# Altium schematic sheet p.SchDoc
size A1
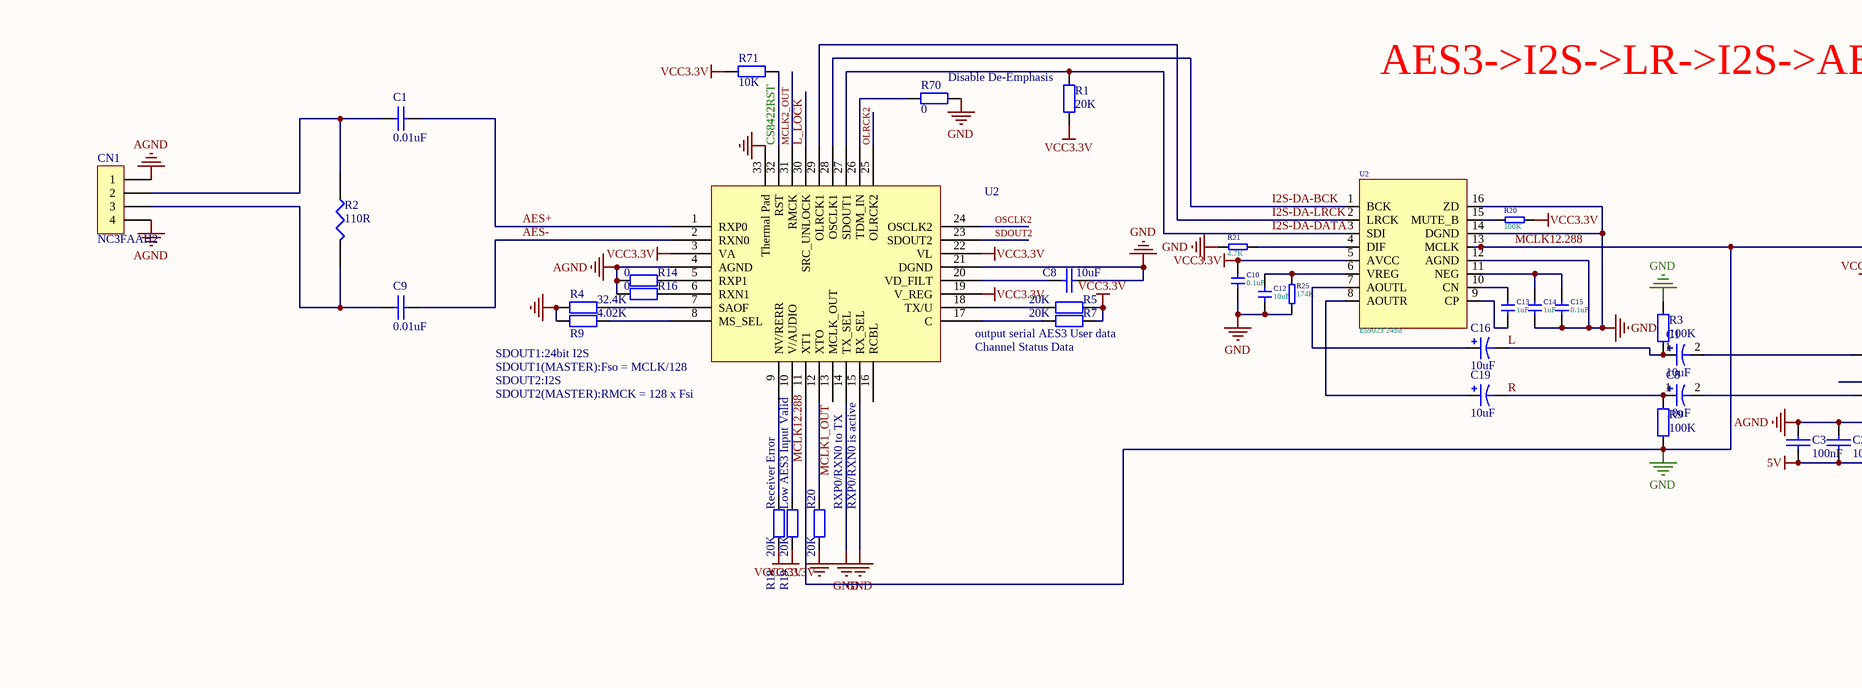
[diagram p0: p.SchDoc, top left]
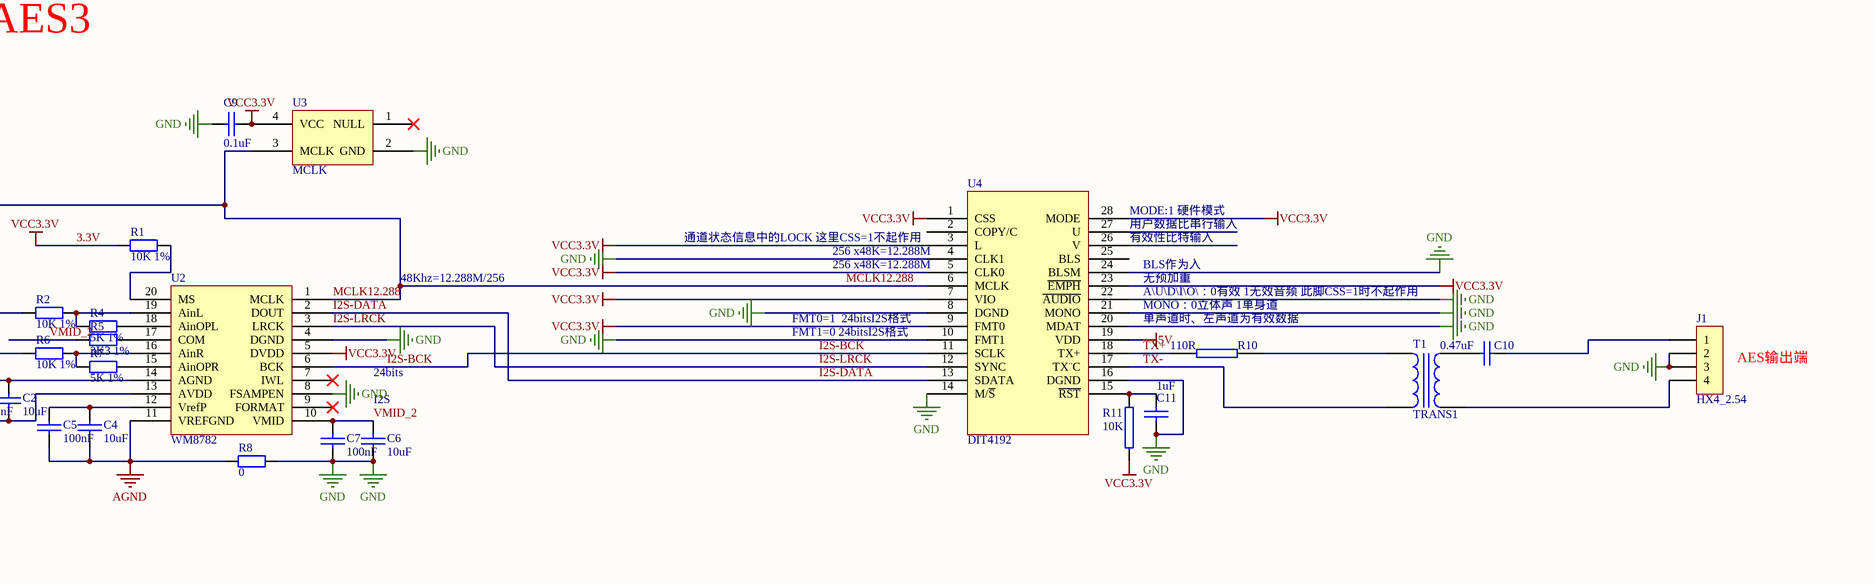
[diagram p1: p.SchDoc, top right]
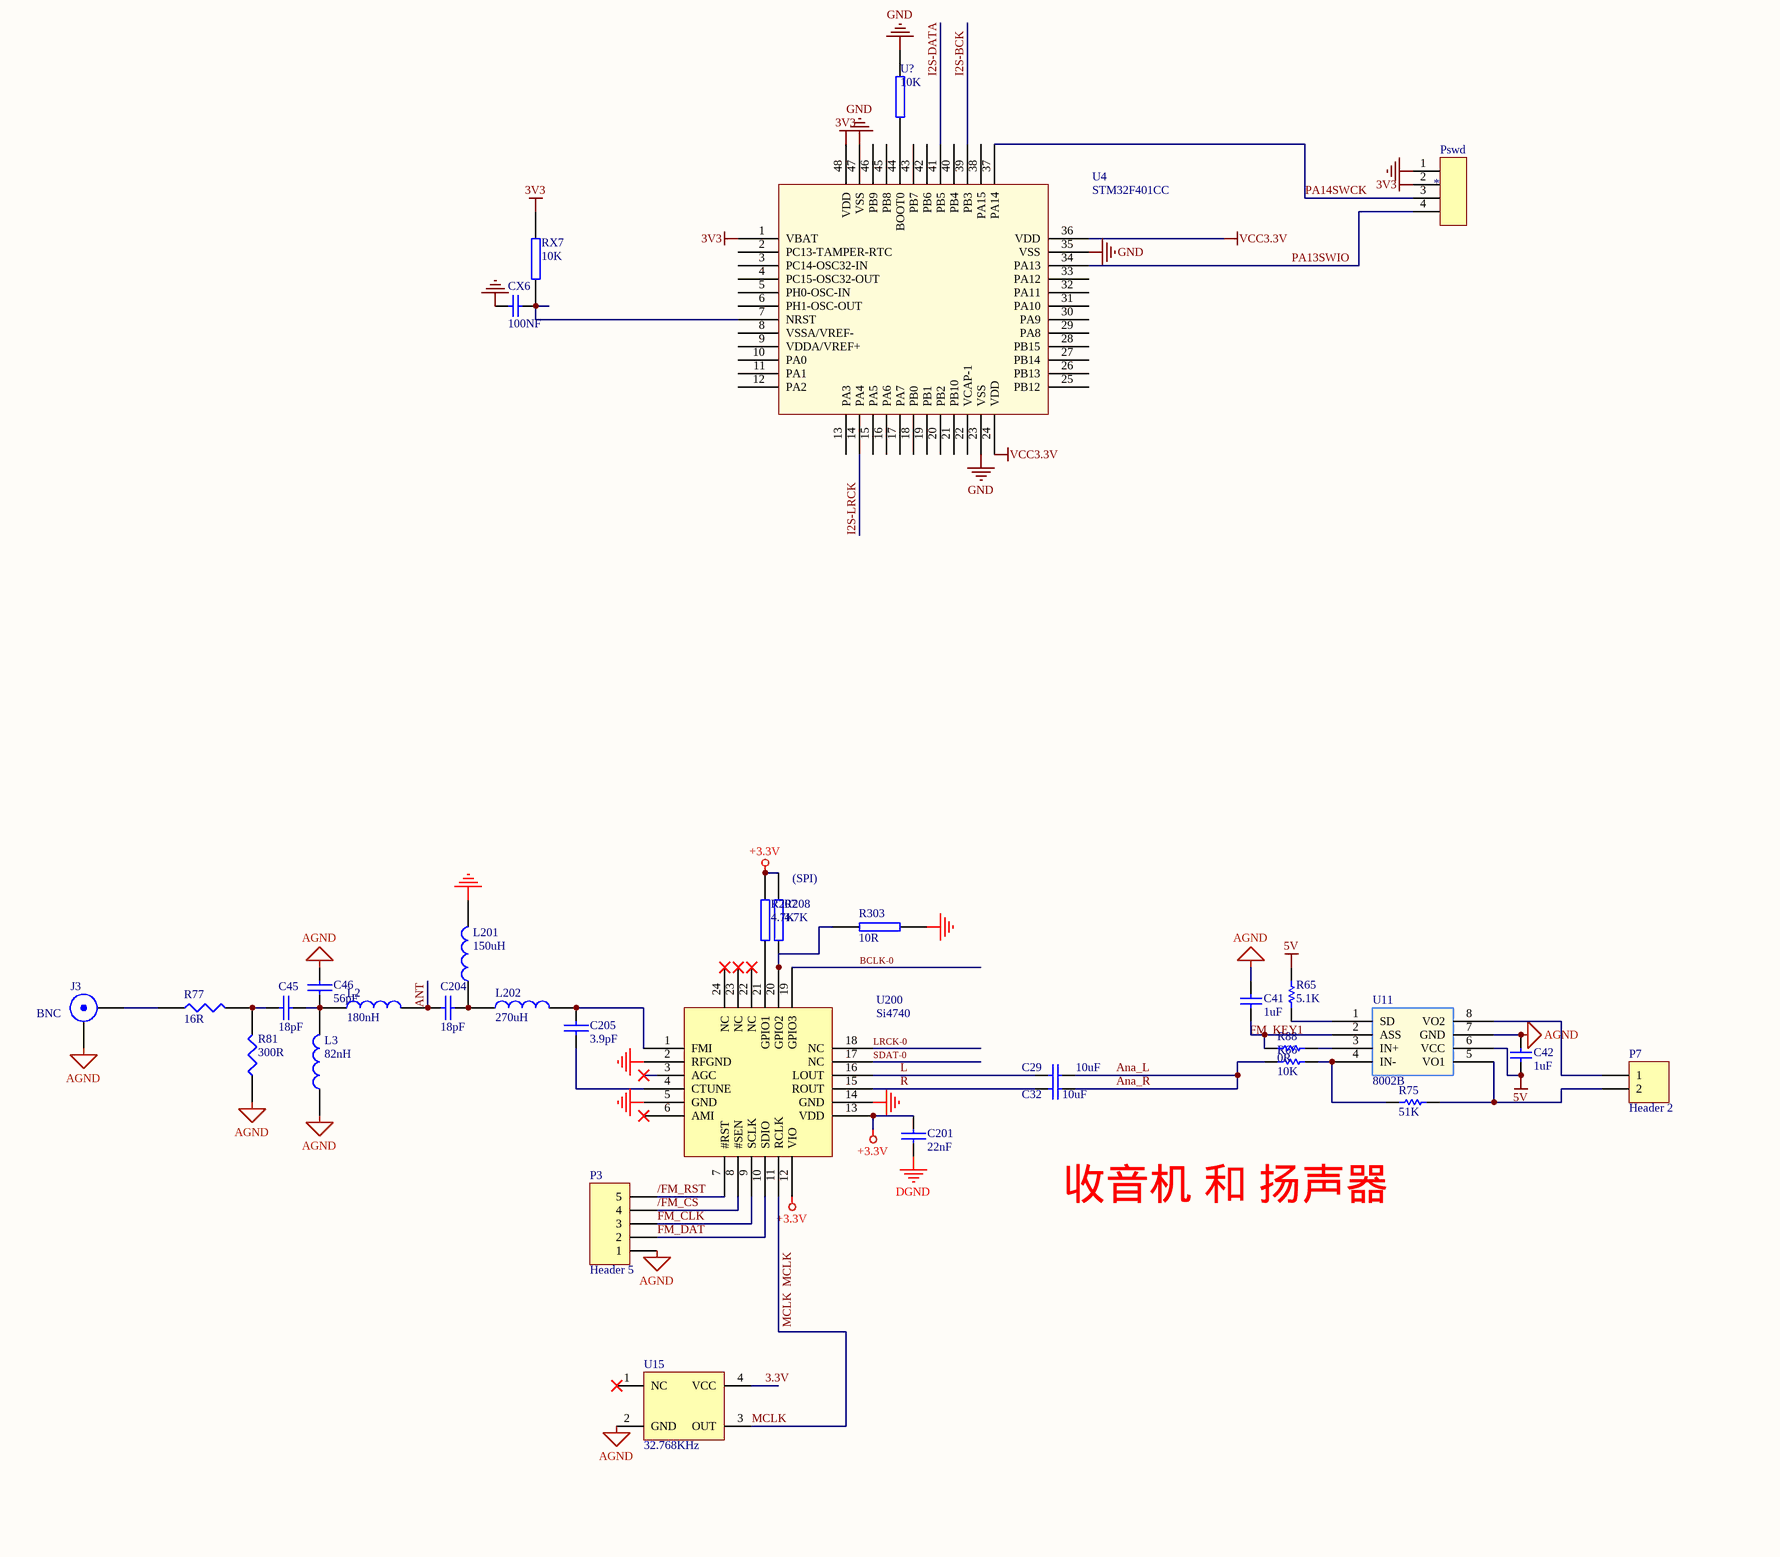
[diagram p2: p.SchDoc, bottom left]
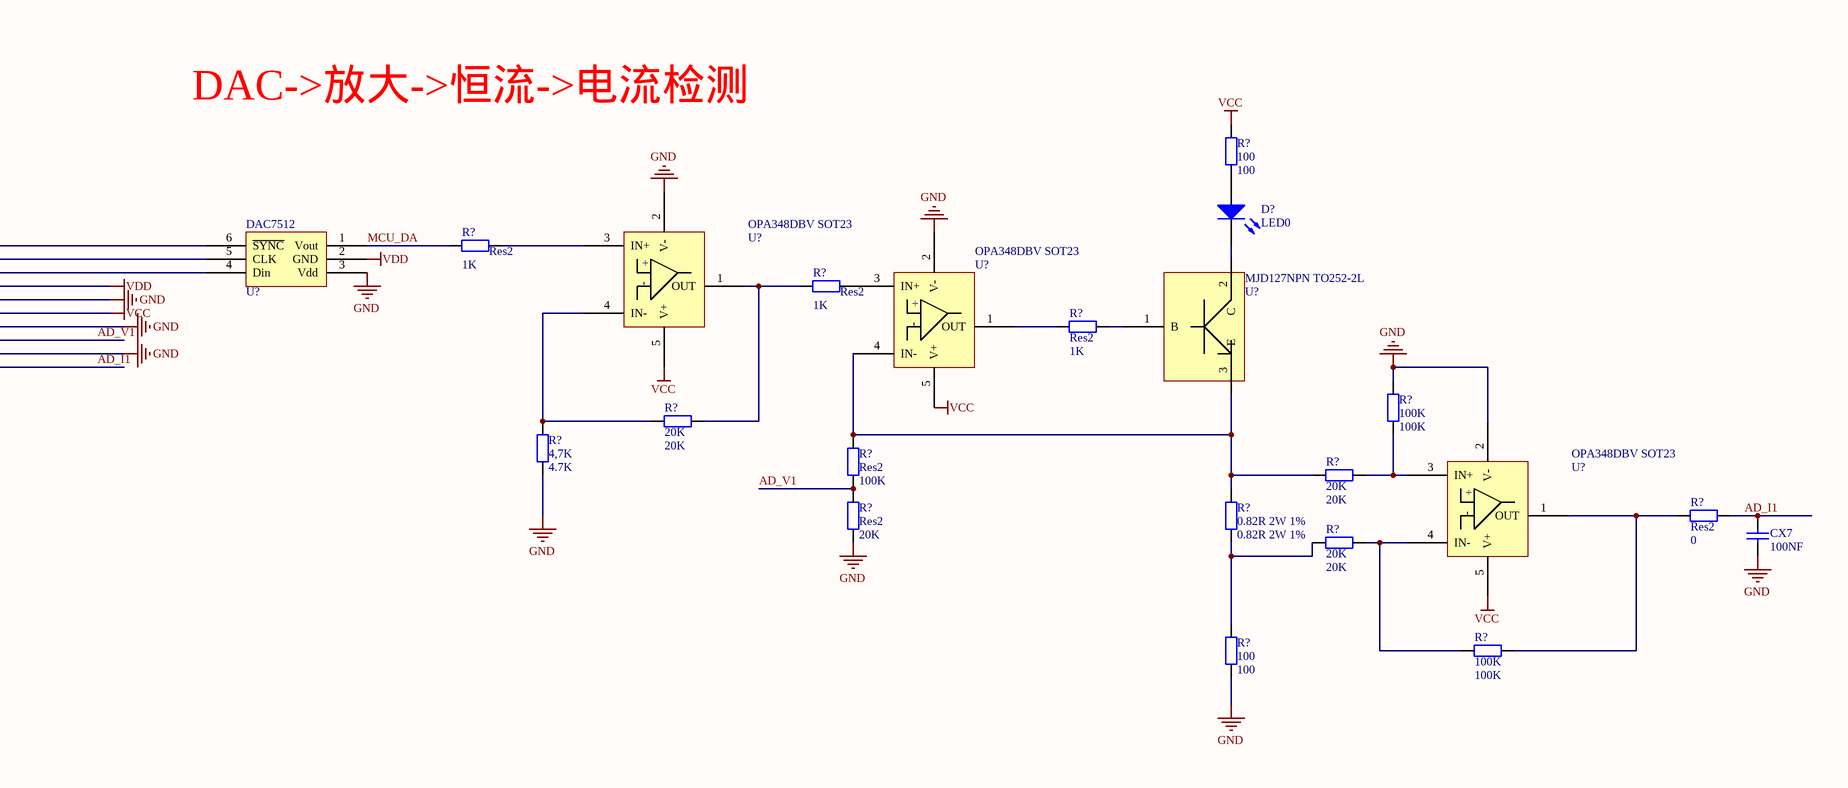
[diagram p3: p.SchDoc, bottom right]

## Parts
(Parts that share a designator on the sheet are numbered #1, #2 ... from top to bottom, then left to right.)
C1#1  0.01uF  [0805C]
C1#2  10uF  [C3528 钽电容]
C2  10uF  [C0805]
C3  100nF  [C0805]
C4  10uF  [C0805]
C5  100nF  [C0805]
C6  10uF  [C0805]
C7  100nF  [C0805]
C8#1  10uF  [0805C]
C8#2  10uF  [C3528 钽电容]
C9#1  0.1uF  [C0805]
C9#2  0.01uF  [0805C]
C10#1  0.1uF  [0805C]
C10#2  0.47uF  [C0805]
C11  1uF  [C0805]
C12  10uF  [C3528]
C13  1uF  [0805C]
C14  1uF  [0805C]
C15  0.1uF  [0805C]
C16  10uF  [0805C]
C19  10uF  [0805C]
C29  10uF  [C0805]
C32  10uF  [C0805]
C41  1uF  [C0805]
C42  1uF  [C0805]
C45  18pF  [C0805]
C46  56pF  [C0805]
C201  22nF  [0805C]
C204  18pF  [0805C]
C205  3.9pF  [0805C]
CN1  NC3FAAH2  [NC3FBH1]
CX6  100NF  [0603]
CX7  100NF  [0603]
D?  LED0  [LED-0]
DAC7512  U?
J1  HX4_2.54  [HDR1X4A]
J3  BNC  [SMA]
L2  180nH  [L1206]
L3  82nH  [L1206]
L201  150uH  [1206R]
L202  270uH  [1206R]
MJD127NPN_TO252-2L  U?
OPA348DBV_SOT23#1  U?
OPA348DBV_SOT23#2  U?
OPA348DBV_SOT23#3  U?
P3  Header 5  [HDR1X5]
P7  Header 2  [HDR1X2A]
Pswd  *  [B4B-XH-A]
R1#1  20K  [0805R]
R1#2  10K 1%  [R0805]
R2#1  110R  [0805R]
R2#2  10K 1%  [R0805]
R3  100K  [R0805]
R4#1  32.4K  [0805R]
R4#2  5K 1%  [R0805]
R5#1  20K  [0805R]
R5#2  3K3 1%  [R0805]
R6  10K 1%  [R0805]
R7#1  20K  [0805R]
R7#2  5K 1%  [R0805]
R8  0  [R0805]
R9#1  4.02K  [0805R]
R9#2  100K  [R0805]
R10  110R  [R0805]
R11  10K  [R0805]
R14  0  [0805R]
R16  0  [0805R]
R18  20K  [0805R]
R19  20K  [0805R]
R20#1  100K  [0805R]
R20#2  20K  [0805R]
R21  4.7K  [0805R]
R25  174K  [0805R]
R65  5.1K  [R0805]
R66  10K  [R0805]
R70  0  [0805R]
R71  10K  [0805R]
R75  51K  [R0805]
R77  16R  [R0805]
R81  300R  [R0805]
R88  0R  [R0805]
R207  4.7K  [0805R]
R208  4.7K  [0805R]
R303  10R  [0805R]
R?#1  100  [AXIAL-0.4]
R?#2  Res2  value 1K  [AXIAL-0.4]
R?#3  Res2  value 1K  [AXIAL-0.4]
R?#4  Res2  value 1K  [AXIAL-0.4]
R?#5  100K  [AXIAL-0.4]
R?#6  4,7K  value 4.7K  [AXIAL-0.4]
R?#7  20K  [AXIAL-0.4]
R?#8  Res2  value 100K  [AXIAL-0.4]
R?#9  20K  [AXIAL-0.4]
R?#10  Res2  value 20K  [AXIAL-0.4]
R?#11  0.82R 2W 1%  [AXIAL-0.4]
R?#12  20K  [AXIAL-0.4]
R?#13  Res2  value 0  [AXIAL-0.4]
R?#14  100  [AXIAL-0.4]
R?#15  100K  [AXIAL-0.4]
RX7  10K  [0603]
T1  TRANS1  [T-10247]
U2#1  ES9023 24bit  [ES9023]
U2#2  CS8422  [QFN32N]  (value not drawn)
U2#3  WM8782  [SSOP20]
U3  MCLK  [XTAL5X7_50MHz]
U4#1  DIT4192  [TSSOP28]
U4#2  STM32F401CC  [STM32F401CC-UFQFPN48]
U11  8002B  [SOP8]
U15  32.768KHz  [10X10-32.768KHZ]
U200  Si4740  [QFN24]
U?  10K  [0603]

## Nets
3.3V: C9#1.1 C10#1.1 R1#1.2 R1#2.2 R5#1.2 R7#1.2 R11.2 R18.2 R19.2 R20#1.1 R71.2 U2#1.5(AVCC) U2#2.3(VA) U2#2.19(V_REG) U2#2.22(VL) U2#3.5(DVDD) U3.4(VCC) U4#1.1(CSS) U4#1.3(L) U4#1.5(CLK0) U4#1.7(VIO) U4#1.9(FMT0) U4#1.23(~{EMPH}) U4#1.28(MODE) U4#2.24(VDD) U4#2.36(VDD) U15.4(VCC)  [also labelled VCC3.3V]
3V3: Pswd.2 RX7.2 U4#2.1(VBAT) U4#2.48(VDD)
5V: C2.1 C3.1 C42.2 R65.2 U2#3.13(AVDD) U4#1.19(VDD) U11.6(VCC)
+3.3V: C201.1 R207.2 R208.2 U200.12(VIO) U200.13(VDD)
AGND: C2.2 C3.2 C4.1 C5.1 C41.1 C42.1 C46.1 CN1.1 CN1.4 J3.2(Y) L3.1 P3.1 R8.2 R14.2 R16.2 R81.1 U2#2.4(AGND) U2#3.11(VREFGND) U2#3.14(AGND) U11.7(GND) U15.2(GND)
DGND: C201.2 L201.2 R303.1 U200.2(RFGND) U200.5(GND) U200.14(GND)
MCLK12.288: C6.1 C7.1 C8#1.2 C9#1.2 C10#1.2 C11.1 C12.2 C14.2 C15.2 CX6.2 CX7.1 DAC7512.3(Vdd) J1.2 J1.3 OPA348DBV_SOT23#1.2(V-) OPA348DBV_SOT23#2.2(V-) OPA348DBV_SOT23#3.2(V-) Pswd.1 R3.1 R4#1.2 R8.1 R9#1.2 R9#2.1 R20#2.2 R21.2 R25.1 R70.1 R?#5.2 R?#6.2 R?#10.2 R?#14.2 U2#1.12(AGND) U2#1.13(MCLK) U2#1.14(DGND) U2#1.16(ZD) U2#2.11(XT1) U2#2.14(TX_SEL) U2#2.15(RX_SEL) U2#2.21(DGND) U2#2.33(Thermal_Pad) U2#3.1(MCLK) U2#3.4(DGND) U2#3.8(FSAMPEN) U3.2(GND) U3.3(MCLK) U4#1.4(CLK1) U4#1.6(MCLK) U4#1.8(DGND) U4#1.10(FMT1) U4#1.14(M/~{S}) U4#1.16(DGND) U4#1.20(MDAT) U4#1.21(MONO) U4#1.22(~{AUDIO}) U4#1.24(BLSM) U4#2.23(VSS) U4#2.35(VSS) U4#2.47(VSS) U?.2  [also labelled GND]
VCC: OPA348DBV_SOT23#1.5(V+) OPA348DBV_SOT23#2.5(V+) OPA348DBV_SOT23#3.5(V+) R?#1.2
VDD: DAC7512.2(GND)
/FM_CS: P3.4 U200.8(#SEN)
/FM_RST: P3.5 U200.7(#RST)
AD_I1: CX7.2 R?#13.1
AD_V1: R?#8.2 R?#10.1
AES+: C1#1.2 U2#2.1(RXP0)
AES-: C9#2.1 U2#2.2(RXN0)
Ana_L: C29.2 C32.2 R66.1  [also labelled Ana_R]
ANT: C204.1 L2.2
BCLK-0: U200.19(GPIO3)
CS8422RST: R71.1 U2#2.32(RST)
FM_CLK: P3.3 U200.9(SCLK)
FM_DAT: P3.2 U200.10(SDIO)
FM_KEY1: R65.1 U11.1(SD)
I2S-BCK: U2#3.6(BCK) U4#1.11(SCLK) U4#2.39(PB3)
I2S-DA-BCK: U2#1.1(BCK) U2#2.28(OSCLK1)
I2S-DA-DATA: R1#1.1 U2#1.3(SDI) U2#2.27(SDOUT1)
I2S-DA-LRCK: U2#1.2(LRCK) U2#2.29(OLRCK1)
I2S-DATA: U2#3.2(DOUT) U4#1.13(SDATA) U4#2.41(PB5)
I2S-LRCK: U2#3.3(LRCK) U4#1.12(SYNC) U4#2.14(PA4)
L: C1#2.1 C16.2 C29.1 R3.2 U200.16(LOUT)
L_LOCK: U2#2.30(SRC_UNLOCK)
LRCK-0: U200.18(NC)
MCLK: U15.3(OUT) U200.11(RCLK)
MCLK2_OUT: U2#2.31(RMCK)
MCU_DA: DAC7512.1(Vout) R?#2.2
OLRCK2: U2#2.25(OLRCK2)
OSCLK2: U2#2.24(OSCLK2)
PA13SWIO: Pswd.4 U4#2.34(PA13)
PA14SWCK: Pswd.3 U4#2.37(PA14)
R: C8#2.1 C19.2 C32.1 R9#2.2 U200.15(ROUT)
SDAT-0: U200.17(NC)
SDOUT2: U2#2.23(SDOUT2)
TX+: R10.1 U4#1.18(TX+)
TX-: T1.3 U4#1.17(TX¨C)
VMID_2: C6.2 C7.2 R5#2.2 U2#3.10(VMID)
NetC1#1_1: C1#1.1 CN1.2 R2#1.1
NetC1#2_2: C1#2.2 R2#2.2
NetC4_2: C4.2 C5.2 U2#3.12(VrefP)
NetC8#1_1: C8#1.1 U2#2.20(VD_FILT)
NetC8#2_2: C8#2.2 R6.2
NetC9#2_2: C9#2.2 CN1.3 R2#1.2
NetC10#2_1: C10#2.1 J1.1
NetC10#2_2: C10#2.2 T1.2
NetC11_2: C11.2 R11.1 U4#1.15(~{RST})
NetC12_1: C12.1 R25.2 U2#1.6(VREG)
NetC13_1: C13.1 U2#1.10(CN)
NetC13_2: C13.2 U2#1.9(CP)
NetC14_1: C14.1 C15.1 U2#1.11(NEG)
NetC16_1: C16.1 U2#1.7(AOUTL)
NetC19_1: C19.1 U2#1.8(AOUTR)
NetC41_2: C41.2 R88.1 U11.2(ASS)
NetC45_1: C45.1 R77.2 R81.2
NetC45_2: C45.2 C46.2 L2.1 L3.2
NetC204_2: C204.2 L201.1 L202.1
NetC205_1: C205.1 L202.2 U200.1(FMI)
NetC205_2: C205.2 U200.4(CTUNE)
NetCX6_1: CX6.1 RX7.1 U4#2.7(NRST)
NetD?_1: D?.1(A) R?#1.1
NetD?_2: D?.2(K) MJD127NPN_TO252-2L.2(C)
NetJ1_4: J1.4 T1.4
NetJ3_1: J3.1(X) R77.1
NetMJD127NPN_TO252-2L_1: MJD127NPN_TO252-2L.1(B) R?#4.1
NetMJD127NPN_TO252-2L_3: MJD127NPN_TO252-2L.3(E) OPA348DBV_SOT23#2.4(IN-) R?#8.1 R?#9.1 R?#11.1
NetOPA348DBV_SOT23#1_1: OPA348DBV_SOT23#1.1(OUT) R?#3.2 R?#7.1
NetOPA348DBV_SOT23#1_3: OPA348DBV_SOT23#1.3(IN+) R?#2.1
NetOPA348DBV_SOT23#1_4: OPA348DBV_SOT23#1.4(IN-) R?#6.1 R?#7.2
NetOPA348DBV_SOT23#2_1: OPA348DBV_SOT23#2.1(OUT) R?#4.2
NetOPA348DBV_SOT23#2_3: OPA348DBV_SOT23#2.3(IN+) R?#3.1
NetOPA348DBV_SOT23#3_1: OPA348DBV_SOT23#3.1(OUT) R?#13.2 R?#15.1
NetOPA348DBV_SOT23#3_3: OPA348DBV_SOT23#3.3(IN+) R?#5.1 R?#9.2
NetOPA348DBV_SOT23#3_4: OPA348DBV_SOT23#3.4(IN-) R?#12.2 R?#15.2
NetP7_1: P7.1 U11.8(VO2)
NetP7_2: P7.2 R75.1 U11.5(VO1)
NetR1#2_1: R1#2.1 U2#3.20(MS)
NetR2#2_1: R2#2.1 R4#2.2 U2#3.19(AinL)
NetR4#1_1: R4#1.1 U2#2.7(SAOF)
NetR4#2_1: R4#2.1 U2#3.18(AinOPL)
NetR5#1_1: R5#1.1 U2#2.18(TX/U)
NetR5#2_1: R5#2.1 U2#3.17(COM)
NetR6_1: R6.1 R7#2.2 U2#3.16(AinR)
NetR7#1_1: R7#1.1 U2#2.17(C)
NetR7#2_1: R7#2.1 U2#3.15(AinOPR)
NetR9#1_1: R9#1.1 U2#2.8(MS_SEL)
NetR10_2: R10.2 T1.1
NetR14_1: R14.1 U2#2.5(RXP1)
NetR16_1: R16.1 U2#2.6(RXN1)
NetR18_1: R18.1 U2#2.9(NV/RERR)
NetR19_1: R19.1 U2#2.10(V/AUDIO)
NetR20#1_2: R20#1.2 U2#1.15(MUTE_B)
NetR20#2_1: R20#2.1 U2#2.12(XTO)
NetR21_1: R21.1 U2#1.4(DIF)
NetR66_2: R66.2 R75.2 U11.4(IN-)
NetR70_2: R70.2 U2#2.26(TDM_IN)
NetR88_2: R88.2 U11.3(IN+)
NetR207_1: R207.1 U200.21(GPIO1)
NetR208_1: R208.1 R303.2 U200.20(GPIO2)
NetR?#11_2: R?#11.2 R?#12.1 R?#14.1
NetU4#2_44: U4#2.44(BOOT0) U?.1

Not connected (* = marked no-connect by the designer): DAC7512 4(Din) 5(CLK) 6(~{SYNC}); U2#2 13(MCLK_OUT) 16(RCBL); U2#3 7(IWL)* 9(FORMAT)*; U3 1(NULL)*; U4#1 2(COPY/C) 25(BLS) 26(V) 27(U); U4#2 2(PC13-TAMPER-RTC) 3(PC14-OSC32-IN) 4(PC15-OSC32-OUT) 5(PH0-OSC-IN) 6(PH1-OSC-OUT) 8(VSSA/VREF-) 9(VDDA/VREF+) 10(PA0) 11(PA1) 12(PA2) 13(PA3) 15(PA5) 16(PA6) 17(PA7) 18(PB0) 19(PB1) 20(PB2) 21(PB10) 22(VCAP-1) 25(PB12) 26(PB13) 27(PB14) 28(PB15) 29(PA8) 30(PA9) 31(PA10) 32(PA11) 33(PA12) 38(PA15) 40(PB4) 42(PB6) 43(PB7) 45(PB8) 46(PB9); U15 1(NC)*; U200 3(AGC)* 6(AMI)* 22(NC)* 23(NC)* 24(NC)*

## Notes on the sheet
- (near R1#1) Disable De-Emphasis
- AES3->I2S->LR->I2S->AES3
- (near U4#1) MODE:1 硬件模式
- (near U4#1) 用户数据比串行输入
- (near R7#1) output serial AES3 User data
- (near U2#3) 48Khz=12.288M/256
- 通道状态信息中的LOCK 这里CSS=1不起作用
- (near U4#1) 256 x48K=12.288M
- (near U4#1) 有效性比特输入
- BLS作为入
- A\U\D\I\O\：0有效 1无效音频 此脚CSS=1时不起作用
- 无预加重
- SDOUT1:24bit I2S
- SDOUT2:I2S
- SDOUT1(MASTER):Fso = MCLK/128
- (near U2#2) SDOUT2(MASTER):RMCK = 128 x Fsi
- Channel Status Data
- FMT1=0 24bitsI2S格式
- FMT0=1  24bitsI2S格式
- MONO：0立体声 1单身道
- (near R10) 单声道时、左声道为有效数据
- (near J1) AES输出端
- 24bits
- I2S
- (near R18) Receiver Error
- Low AES3 Input Valid
- (near R20#2) RXP0/RXN0 to TX
- RXP0/RXN0 is active
- (SPI)
- DAC->放大->恒流->电流检测
- 收音机 和 扬声器
- Labels drawn without touching a wire or pin: MCLK1_OUT
- (in symbol OPA348DBV) +     -

## Library data of the parts
C1#1 C2-C7 C8#1 C9#1 C9#2 C10#2 C11 C45 C46 C201 C204 C205 = CAP: Capacitor
C1#2 C8#2 C16 C19 = Cap Pol3: Polarized Capacitor (Surface Mount); Value: 10uF
C10#1 C12-C15 = CAP: C?
C29 C32 = Cap: Capacitor; Value: 0.1uF; Published: 8-Jun-2000; LatestRevisionDate: 17-Jul-2002; LatestRevisionNote: Re-released for DXP Platform.; PackageReference: RAD-0.3; Publisher: Altium Limited; PackageDescription: Radial Cap, Thru-Hole; 2 Leads; 0.3 in Pin Spacing
C41 C42 = Cap: Capacitor; Published: 8-Jun-2000; LatestRevisionDate: 17-Jul-2002; LatestRevisionNote: Re-released for DXP Platform.; PackageReference: RAD-0.3; Publisher: Altium Limited; PackageDescription: Radial Cap, Thru-Hole; 2 Leads; 0.3 in Pin Spacing; Value: 1uF
CN1 J1 = CON4: Connector
CX6 CX7 = 104: Capacitor
D? = LED0: Typical INFRARED GaAs LED; Published: 8-Jun-2000; LatestRevisionDate: 08-Jul-2005; LatestRevisionNote: Mech Layer 1 removed.; PackageReference: LED-0; Publisher: Altium Limited; PackageDescription: LED; 2 Leads
DAC7512 = DAC7512
J3 = BNC: BNC Connector
L2 L3 L201 L202 = INDUCTOR
MJD127NPN_TO252-2L = MJD127: MJD127NPN
OPA348DBV_SOT23#1-OPA348DBV_SOT23#3 = OPA348DBV
P3 = Header 5: Header, 5-Pin; LatestRevisionDate: 17-Jul-2002; LatestRevisionNote: Re-released for DXP Platform.; Publisher: Altium Limited
P7 = Header 2: Header, 2-Pin; LatestRevisionDate: 17-Jul-2002; LatestRevisionNote: Re-released for DXP Platform.; Publisher: Altium Limited
Pswd = 锟接诧拷锟斤拷锟?P
R1#1 R1#2 R2#2 R3 R4#1 R4#2 R5#1 R5#2 R6 R7#1 R7#2 R8 R9#1 R9#2 R14 R16 R18 R19 R20#2 R70 R71 R?#1-R?#15 = Res2: Resistor; Published: 8-Jun-2000; LatestRevisionDate: 17-Jul-2002; LatestRevisionNote: Re-released for DXP Platform.; PackageReference: AXIAL-0.4; Publisher: Altium Limited
  R1#1 R5#1 R7#1 R18 R19 R20#2: Value: 20K
  R1#2 R2#2 R6 R71: Value: 10K
  R3 R9#2: Value: 100K
  R4#1: Value: 32.4K
  R4#2 R7#2: Value: 5K
  R5#2: Value: 3K3
  R8 R14 R16 R70: Value: 0
  R9#1: Value: 4.02K
  R?#1 R?#14: PackageDescription: Axial Device, Thru-Hole; 2 Leads; 0.4 in Pin Spacing; Value: 100
  R?#2-R?#4 R?#6 R?#8 R?#10 R?#13: PackageDescription: Axial Device, Thru-Hole; 2 Leads; 0.4 in Pin Spacing
  R?#5 R?#15: PackageDescription: Axial Device, Thru-Hole; 2 Leads; 0.4 in Pin Spacing; Value: 100K
  R?#7 R?#9 R?#12: PackageDescription: Axial Device, Thru-Hole; 2 Leads; 0.4 in Pin Spacing; Value: 20K
  R?#11: PackageDescription: Axial Device, Thru-Hole; 2 Leads; 0.4 in Pin Spacing; Value: 0.82R 2W 1%
R2#1 R77 R81 = RES1
R10 R11 R207 R208 R303 RX7 U? = RES2
R20#1 R21 R25 = RES: R?
R65 R66 R75 R88 = Res Semi: Semiconductor Resistor; Published: 8-Jun-2000; LatestRevisionDate: 17-Jul-2002; LatestRevisionNote: Re-released for DXP Platform.; PackageReference: AXIAL-0.5; Publisher: Altium Limited; PackageDescription: Axial Device, Thru-Hole; 2 Leads; 0.5 in Pin Spacing
  R65: Value: 5.1K
  R66: Value: 10K
  R75: Value: 51k
  R88: Value: 0R
U2#1 = ES9023: AUDIO DAC WITH HEADPHONE OUTPUT